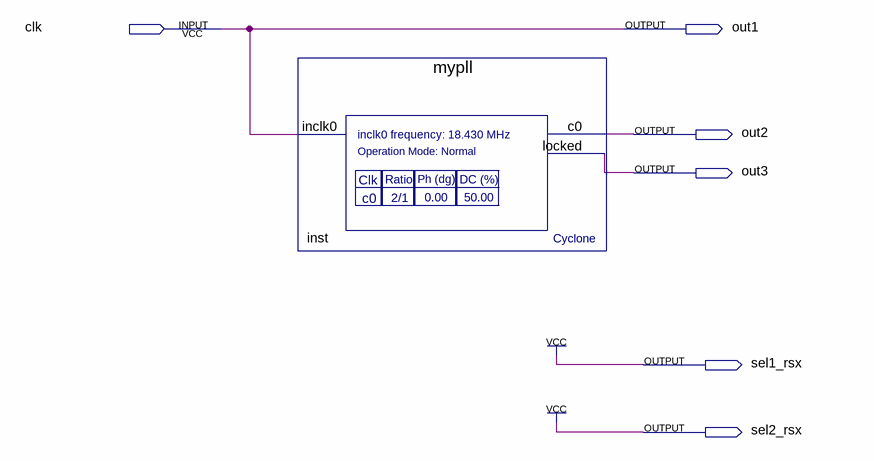
[diagram p0: schematic sheet]
// Quartus schematic top.bdf as structural Verilog: 1 symbols, 6 pins
module top (
  input  clk,
  output out1,
  output out2,
  output out3,
  output sel1_rsx,
  output sel2_rsx
);

  mypll inst (.inclk0(clk), .c0(out2), .locked(out3));

  assign out1 = clk;
  assign sel1_rsx = 1'b1;
  assign sel2_rsx = 1'b1;
endmodule
